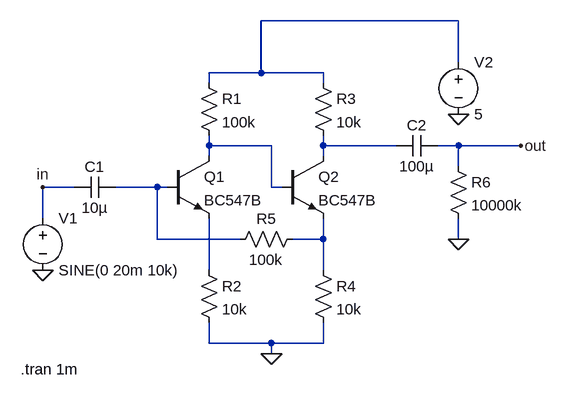
[diagram p0: schematic preamp.asc]
preamp.asc, the LTspice schematic file:
Version 4
SHEET 1 880 680
WIRE 208 -16 -96 -16
WIRE 208 48 208 -16
WIRE -96 64 -96 -16
WIRE -96 64 -176 64
WIRE 0 64 -96 64
WIRE -176 80 -176 64
WIRE 0 80 0 64
WIRE -176 176 -176 160
WIRE -80 176 -176 176
WIRE 0 176 0 160
WIRE 112 176 0 176
WIRE 208 176 176 176
WIRE 304 176 208 176
WIRE -176 192 -176 176
WIRE 0 192 0 176
WIRE 208 208 208 176
WIRE -384 240 -432 240
WIRE -256 240 -320 240
WIRE -240 240 -256 240
WIRE -80 240 -80 176
WIRE -64 240 -80 240
WIRE -432 288 -432 240
WIRE -256 320 -256 240
WIRE -128 320 -256 320
WIRE 0 320 0 288
WIRE 0 320 -48 320
WIRE 208 320 208 288
WIRE -176 368 -176 288
WIRE 0 368 0 320
WIRE -176 480 -176 448
WIRE -80 480 -176 480
WIRE 0 480 0 448
WIRE 0 480 -80 480
WIRE -80 496 -80 480
FLAG -80 496 0
FLAG 208 128 0
FLAG -432 368 0
FLAG 208 320 0
FLAG 304 176 out
FLAG -432 240 in
SYMBOL res -192 64 R0
SYMATTR InstName R1
SYMATTR Value 100k
SYMBOL res -192 352 R0
SYMATTR InstName R2
SYMATTR Value 10k
SYMBOL res -16 64 R0
SYMATTR InstName R3
SYMATTR Value 10k
SYMBOL res -16 352 R0
SYMATTR InstName R4
SYMATTR Value 10k
SYMBOL res -32 304 R90
WINDOW 0 0 56 VBottom 2
WINDOW 3 32 56 VTop 2
SYMATTR InstName R5
SYMATTR Value 100k
SYMBOL cap -320 224 R90
WINDOW 0 0 32 VBottom 2
WINDOW 3 32 32 VTop 2
SYMATTR InstName C1
SYMATTR Value 10µ
SYMBOL cap 176 160 R90
WINDOW 0 0 32 VBottom 2
WINDOW 3 32 32 VTop 2
SYMATTR InstName C2
SYMATTR Value 100µ
SYMBOL npn -240 192 R0
SYMATTR InstName Q1
SYMATTR Value BC547B
SYMBOL npn -64 192 R0
SYMATTR InstName Q2
SYMATTR Value BC547B
SYMBOL voltage -432 272 R0
WINDOW 123 0 0 Left 0
WINDOW 39 0 0 Left 0
SYMATTR InstName V1
SYMATTR Value SINE(0 20m 10k)
SYMBOL voltage 208 32 R0
WINDOW 123 0 0 Left 0
WINDOW 39 0 0 Left 0
SYMATTR InstName V2
SYMATTR Value 5
SYMBOL res 192 192 R0
SYMATTR InstName R6
SYMATTR Value 10000k
TEXT -466 520 Left 2 !.tran 1m

The netlist it stands for:
* preamp.asc
R1 N001 N002 100k
R2 N006 0 10k
R3 N001 N003 10k
R4 N005 0 10k
R5 N005 N004 100k
C1 N004 in 10µ
C2 out N003 100µ
Q1 N002 N004 N006 0 BC547B
Q2 N003 N002 N005 0 BC547B
V1 in 0 SINE(0 20m 10k)
V2 N001 0 5
R6 out 0 10000k
.model NPN NPN
.model PNP PNP
.lib standard.bjt
.tran 1m
.backanno
.end